# Altium schematic sheet Smart_Reclyce_Bin.SchDoc
size A3
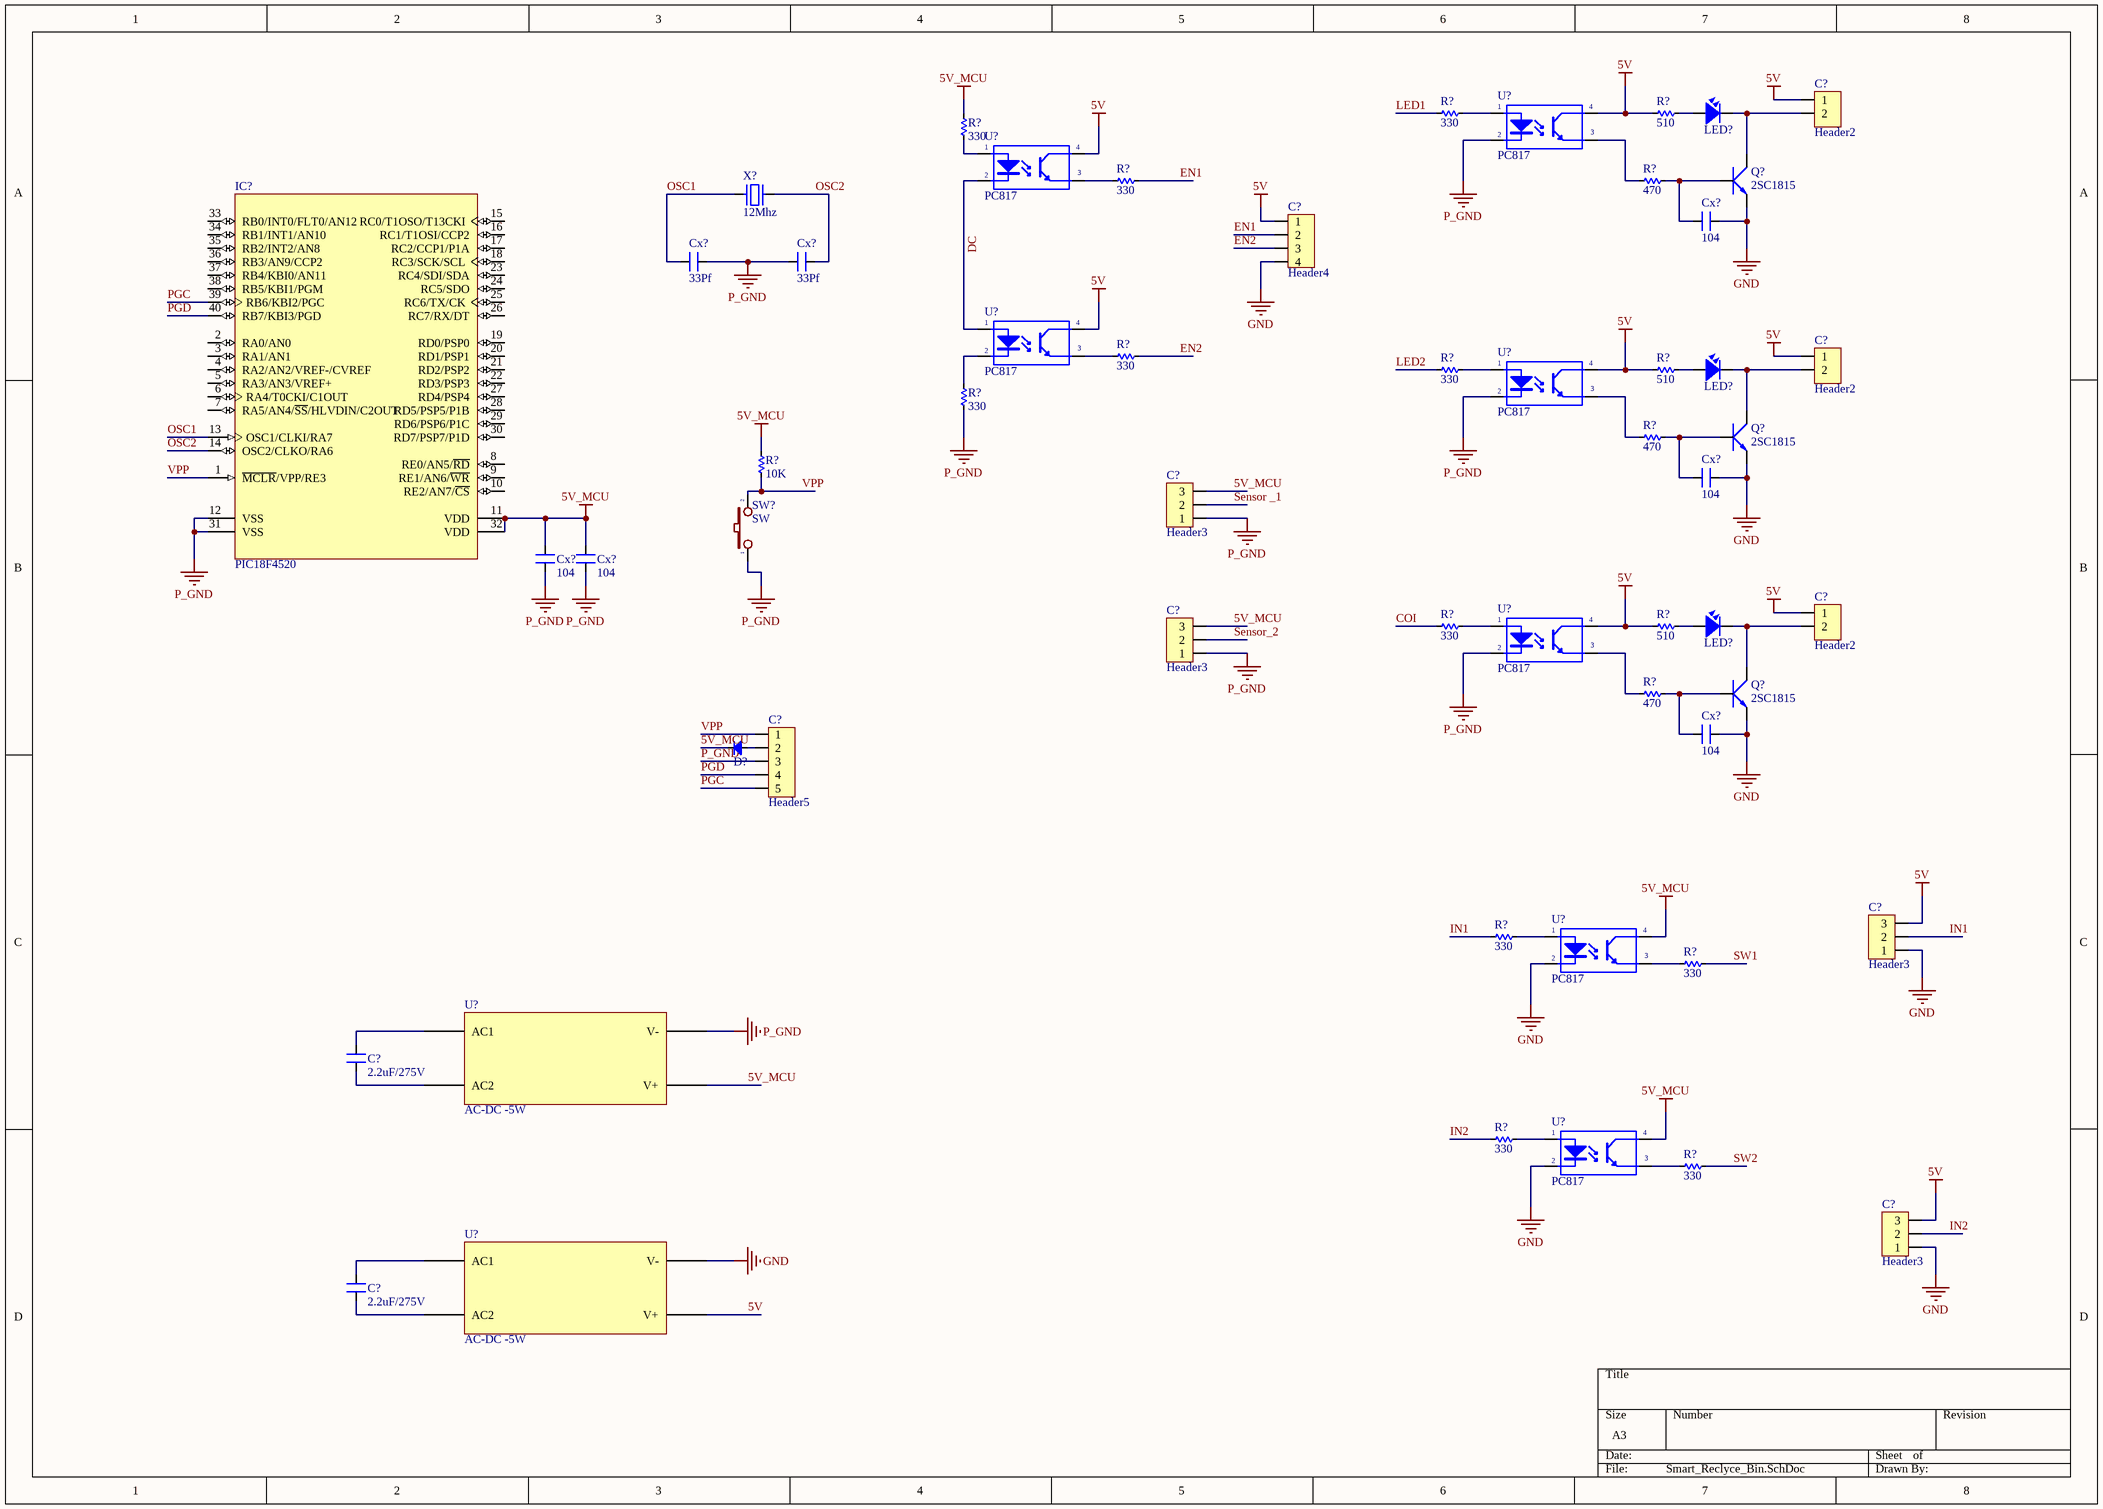
[diagram p0: Smart_Reclyce_Bin.SchDoc]

## Parts
(Parts that share a designator on the sheet are numbered #1, #2 ... from top to bottom, then left to right.)
C?#1  Header2  [Header2]
C?#2  Header4  [Header4]
C?#3  Header2  [Header2]
C?#4  Header3  [HDR3]
C?#5  Header2  [Header2]
C?#6  Header3  [HDR3]
C?#7  Header5  [HDR5]
C?#8  Header3  [Header3]
C?#9  2.2uF/275V  [C-SE-27,5x31x29x15,5x4]
C?#10  Header3  [Header3]
C?#11  2.2uF/275V  [C-SE-27,5x31x29x15,5x4]
Cx?#1  104  [CN-SMD-0805]
Cx?#2  33Pf  [CN-SMD-0805]
Cx?#3  33Pf  [CN-SMD-0805]
Cx?#4  104  [CN-SMD-0805]
Cx?#5  104  [CN-SMD-0805]
Cx?#6  104  [CN-SMD-0805]
Cx?#7  104  [CN-SMD-0805]
D?  Diode  [DIO-1A]  (value not drawn)
IC?  PIC18F4520  [DIP40/W0.6]
LED?#1  LED  [LED-0805-Red]  (value not drawn)
LED?#2  LED  [LED-0805-Red]  (value not drawn)
LED?#3  LED  [LED-0805-Red]  (value not drawn)
Q?#1  2SC1815  [SOT23-321]
Q?#2  2SC1815  [SOT23-321]
Q?#3  2SC1815  [SOT23-321]
R?#1  330  [RES-SMD-0805]
R?#2  510  [RES-SMD-0805]
R?#3  330  [RES-SMD-0805]
R?#4  330  [RES-SMD-0805]
R?#5  470  [RES-SMD-0805]
R?#6  330  [RES-SMD-0805]
R?#7  330  [RES-SMD-0805]
R?#8  510  [RES-SMD-0805]
R?#9  330  [RES-SMD-0805]
R?#10  470  [RES-SMD-0805]
R?#11  10K  [RES-SMD-0805]
R?#12  330  [RES-SMD-0805]
R?#13  510  [RES-SMD-0805]
R?#14  470  [RES-SMD-0805]
R?#15  330  [RES-SMD-0805]
R?#16  330  [RES-SMD-0805]
R?#17  330  [RES-SMD-0805]
R?#18  330  [RES-SMD-0805]
SW?  SW  [SW1-SMD]
U?#1  PC817  [SO4]
U?#2  PC817  [SO4]
U?#3  PC817  [SO4]
U?#4  PC817  [SO4]
U?#5  PC817  [SO4]
U?#6  PC817  [SO4]
U?#7  AC-DC -5W  [MODULE AC-DC-5W]
U?#8  PC817  [SO4]
U?#9  AC-DC -5W  [MODULE AC-DC-5W]
X?  12Mhz  [XTAL-RU49/4]

## Nets
5V: C?#1.1 C?#2.1 C?#3.1 C?#5.1 C?#8.3 C?#10.3 R?#2.2 R?#8.2 R?#13.2 U?#1.4(C) U?#2.4(C) U?#3.4(C) U?#4.4(C) U?#5.4(C) U?#9.V+
5V_MCU: C?#4.3 C?#6.3 Cx?#5.2 Cx?#6.2 D?.2(K) IC?.11(VDD) IC?.32(VDD) R?#3.1 R?#11.1 U?#6.4(C) U?#7.V+ U?#8.4(C)
GND: C?#2.4 C?#8.1 C?#10.1 Cx?#1.1 Cx?#4.1 Cx?#7.1 Q?#1.1(E) Q?#2.1(E) Q?#3.1(E) U?#6.2(K) U?#8.2(K) U?#9.V-
P_GND: C?#4.1 C?#6.1 C?#7.3 Cx?#2.2 Cx?#3.1 Cx?#5.1 Cx?#6.1 IC?.12(VSS) IC?.31(VSS) R?#9.2 SW?.1 U?#1.2(K) U?#4.2(K) U?#5.2(K) U?#7.V-
COI: R?#12.2
DC: U?#2.2(K) U?#3.1(A)
EN1: C?#2.2 R?#4.1
EN2: C?#2.3 R?#6.1
IN1: C?#8.2 R?#15.2
IN2: C?#10.2 R?#17.2
LED1: R?#1.2
LED2: R?#7.2
OSC1: Cx?#2.1 IC?.13(OSC1/CLKI/RA7) X?.1
OSC2: Cx?#3.2 IC?.14(OSC2/CLKO/RA6) X?.2
PGC: C?#7.5 IC?.39(RB6/KBI2/PGC)
PGD: C?#7.4 IC?.40(RB7/KBI3/PGD)
Sensor _1: C?#4.2
Sensor_2: C?#6.2
SW1: R?#16.1
SW2: R?#18.1
VPP: C?#7.1 IC?.1(~{MCLR}/VPP/RE3) R?#11.2 SW?.2
NetC?#1_2: C?#1.2 LED?#1.2 Q?#1.2(C)
NetC?#3_2: C?#3.2 LED?#2.2 Q?#2.2(C)
NetC?#5_2: C?#5.2 LED?#3.2 Q?#3.2(C)
NetC?#7_2: C?#7.2 D?.1(A)
NetC?#9_1: C?#9.1 U?#7.AC2
NetC?#9_2: C?#9.2 U?#7.AC1
NetC?#11_1: C?#11.1 U?#9.AC2
NetC?#11_2: C?#11.2 U?#9.AC1
NetCx?#1_2: Cx?#1.2 Q?#1.3(B) R?#5.1
NetCx?#4_2: Cx?#4.2 Q?#2.3(B) R?#10.1
NetCx?#7_2: Cx?#7.2 Q?#3.3(B) R?#14.1
NetLED?#1_1: LED?#1.1 R?#2.1
NetLED?#2_1: LED?#2.1 R?#8.1
NetLED?#3_1: LED?#3.1 R?#13.1
NetR?#1_1: R?#1.1 U?#1.1(A)
NetR?#3_2: R?#3.2 U?#2.1(A)
NetR?#4_2: R?#4.2 U?#2.3(E)
NetR?#5_2: R?#5.2 U?#1.3(E)
NetR?#6_2: R?#6.2 U?#3.3(E)
NetR?#7_1: R?#7.1 U?#4.1(A)
NetR?#9_1: R?#9.1 U?#3.2(K)
NetR?#10_2: R?#10.2 U?#4.3(E)
NetR?#12_1: R?#12.1 U?#5.1(A)
NetR?#14_2: R?#14.2 U?#5.3(E)
NetR?#15_1: R?#15.1 U?#6.1(A)
NetR?#16_2: R?#16.2 U?#6.3(E)
NetR?#17_1: R?#17.1 U?#8.1(A)
NetR?#18_2: R?#18.2 U?#8.3(E)

Not connected (* = marked no-connect by the designer): IC? 2(RA0/AN0) 3(RA1/AN1) 4(RA2/AN2/VREF-/CVREF) 5(RA3/AN3/VREF+) 6(RA4/T0CKI/C1OUT) 7(RA5/AN4/~{SS}/HLVDIN/C2OUT) 8(RE0/AN5/~{RD}) 9(RE1/AN6/~{WR}) 10(RE2/AN7/~{CS}) 15(RC0/T1OSO/T13CKI) 16(RC1/T1OSI/CCP2) 17(RC2/CCP1/P1A) 18(RC3/SCK/SCL) 19(RD0/PSP0) 20(RD1/PSP1) 21(RD2/PSP2) 22(RD3/PSP3) 23(RC4/SDI/SDA) 24(RC5/SDO) 25(RC6/TX/CK) 26(RC7/RX/DT) 27(RD4/PSP4) 28(RD5/PSP5/P1B) 29(RD6/PSP6/P1C) 30(RD7/PSP7/P1D) 33(RB0/INT0/FLT0/AN12) 34(RB1/INT1/AN10) 35(RB2/INT2/AN8) 36(RB3/AN9/CCP2) 37(RB4/KBI0/AN11) 38(RB5/KBI1/PGM)

## Library data of the parts
C?#1 C?#3 C?#5 = Header2: Header IDC, 2 x 1 Pin Vertical 2.54mm Pitch (Non-Boxed, Male); Manufacturer: W¨¹rth Elektronik eiSos GmbH; partNo: 613002143121; ComponentLink1 Description: Manufacturer; ComponentLink2 Description: Datasheet; NoPins: 02; Created Date: 29 March 2013; ComponentLink1URL: http://www.we-online.com; ComponentLink2URL: http://katalog.we-online.de/em/datasheet/6130xx143121.pdf; Created by: Karrer Zheng
C?#2 = Header4: Header IDC, 4 x 1 Pin Vertical 2.54mm Pitch (Non-Boxed, Male); Manufacturer: W¨¹rth Elektronik eiSos GmbH; partNo: 613002143121; ComponentLink1 Description: Manufacturer; ComponentLink2 Description: Datasheet; NoPins: 02; Created Date: 29 March 2013; ComponentLink1URL: http://www.we-online.com; ComponentLink2URL: http://katalog.we-online.de/em/datasheet/6130xx143121.pdf; Created by: Karrer Zheng
C?#4 C?#6 C?#8 C?#10 = Header3: Header IDC, 3 x 1 Pin Vertical 2.54mm Pitch (Non-Boxed, Male); Manufacturer: W¨¹rth Elektronik eiSos GmbH; partNo: 613002143121; ComponentLink1 Description: Manufacturer; ComponentLink2 Description: Datasheet; NoPins: 02; Created Date: 29 March 2013; ComponentLink1URL: http://www.we-online.com; ComponentLink2URL: http://katalog.we-online.de/em/datasheet/6130xx143121.pdf; Created by: Karrer Zheng
C?#7 = Header5: Header IDC, 5 x 1 Pin Vertical 2.54mm Pitch (Non-Boxed, Male); Manufacturer: W¨¹rth Elektronik eiSos GmbH; partNo: 613002143121; ComponentLink1 Description: Manufacturer; ComponentLink2 Description: Datasheet; NoPins: 02; Created Date: 29 March 2013; ComponentLink1URL: http://www.we-online.com; ComponentLink2URL: http://katalog.we-online.de/em/datasheet/6130xx143121.pdf; Created by: Karrer Zheng
C?#9 C?#11 = CN-SEMI-DIP: Capacitor (Semiconductor SIM Model); Value: 104; LatestRevisionDate: 17-Jul-2002; LatestRevisionNote: Re-released for DXP Platform.; PackageReference: C1206; Publisher: Altium Limited
Cx?#1 Cx?#4-Cx?#7 = CN: Value: 33pF
Cx?#2 Cx?#3 = CN: Value: 33pF
D? = Diode: Default Diode; Code - JEDEC: DO-214-AB; Value: 1N5007; Published: 8-Jun-2000; Revision: July-2002: Re-released for DXP Platform.; Publisher: Altium Limited
IC? = PIC18F4520: 32KB Flash, 1536B RAM, 256B EFROM, 40-Pin PDIP; Value: DIP 40; Value: 18F4520; Copyright by: VanDungEvn
LED?#1-LED?#3 = LED SMD: Value: LED 3 - 5 ly 2 Colour
Q?#1-Q?#3 = 2SC1815: NPN 600mW, ECB; Value: C1815
R?#1-R?#18 = Res-SMD: Resistor; Manufacturer: Generic Components; Class: Passive; Published: 08/06/2000; Publisher: Altium Hobart Technology Centre
SW? = SW2: Switch button 2 pin; Value: SW chip 2 pin
U?#1-U?#6 U?#8 = PC817: Single Opto; Value: PC817
U?#7 U?#9 = MODULE AC-DC -5W
X? = XT2: Crystal, 32.768 KHz, -40 to 85 degC, 3.2 x 1.5 x 0.9 mm SMD; Value: 4Mhz